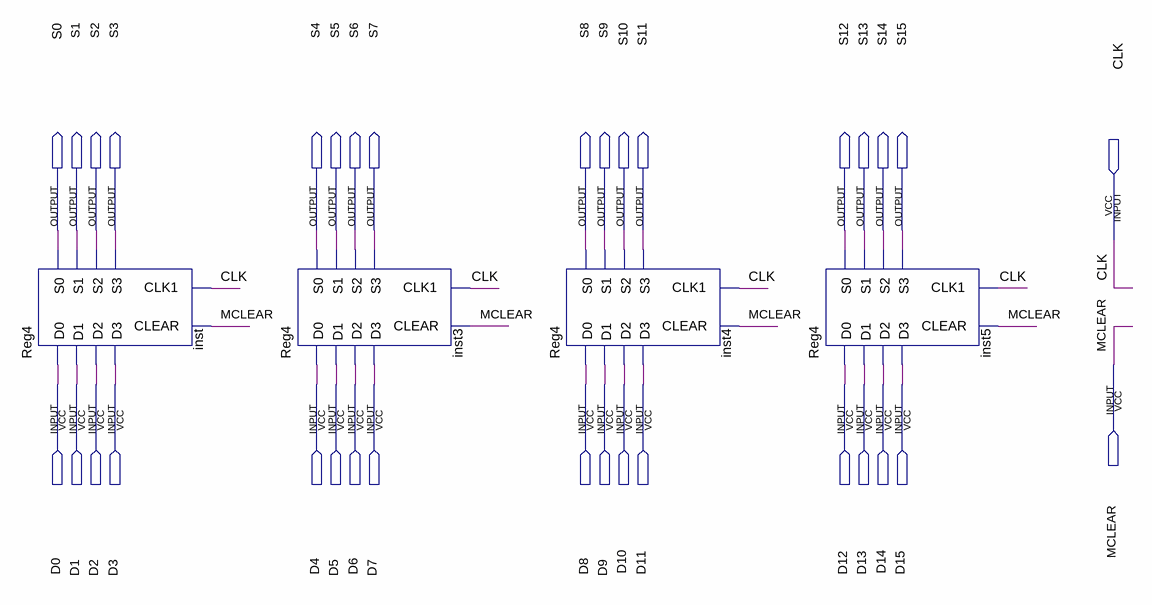
[diagram p0: schematic sheet]
// Quartus schematic Reg16.bdf as structural Verilog: 4 symbols, 34 pins
module Reg16 (
  input  CLK,
  input  MCLEAR,
  input  D0,
  input  D1,
  input  D2,
  input  D3,
  input  D4,
  input  D5,
  input  D6,
  input  D7,
  input  D8,
  input  D9,
  input  D10,
  input  D11,
  input  D12,
  input  D13,
  input  D14,
  input  D15,
  output S0,
  output S1,
  output S2,
  output S3,
  output S4,
  output S5,
  output S6,
  output S7,
  output S8,
  output S9,
  output S10,
  output S11,
  output S12,
  output S13,
  output S14,
  output S15
);

  Reg4 inst (.D0(D0), .D1(D1), .D2(D2), .D3(D3), .CLK1(CLK), .CLEAR(MCLEAR), .S0(S0), .S1(S1), .S2(S2), .S3(S3));
  Reg4 inst3 (.D0(D4), .D1(D5), .D2(D6), .D3(D7), .CLK1(CLK), .CLEAR(MCLEAR), .S0(S4), .S1(S5), .S2(S6), .S3(S7));
  Reg4 inst4 (.D0(D8), .D1(D9), .D2(D10), .D3(D11), .CLK1(CLK), .CLEAR(MCLEAR), .S0(S8), .S1(S9), .S2(S10), .S3(S11));
  Reg4 inst5 (
    .D0(D12), .D1(D13), .D2(D14), .D3(D15), .CLK1(CLK), .CLEAR(MCLEAR), .S0(S12), .S1(S13), .S2(S14), .S3(S15));
endmodule
